# EasyEDA schematic SCH_two-displays_2025-10-05.json
TITLE: Two display module; REV: 1.0; Date: 2025-07-05; Sheet: 1/1; Drawn By: Jakub Pelc; Company: swpelc.eu
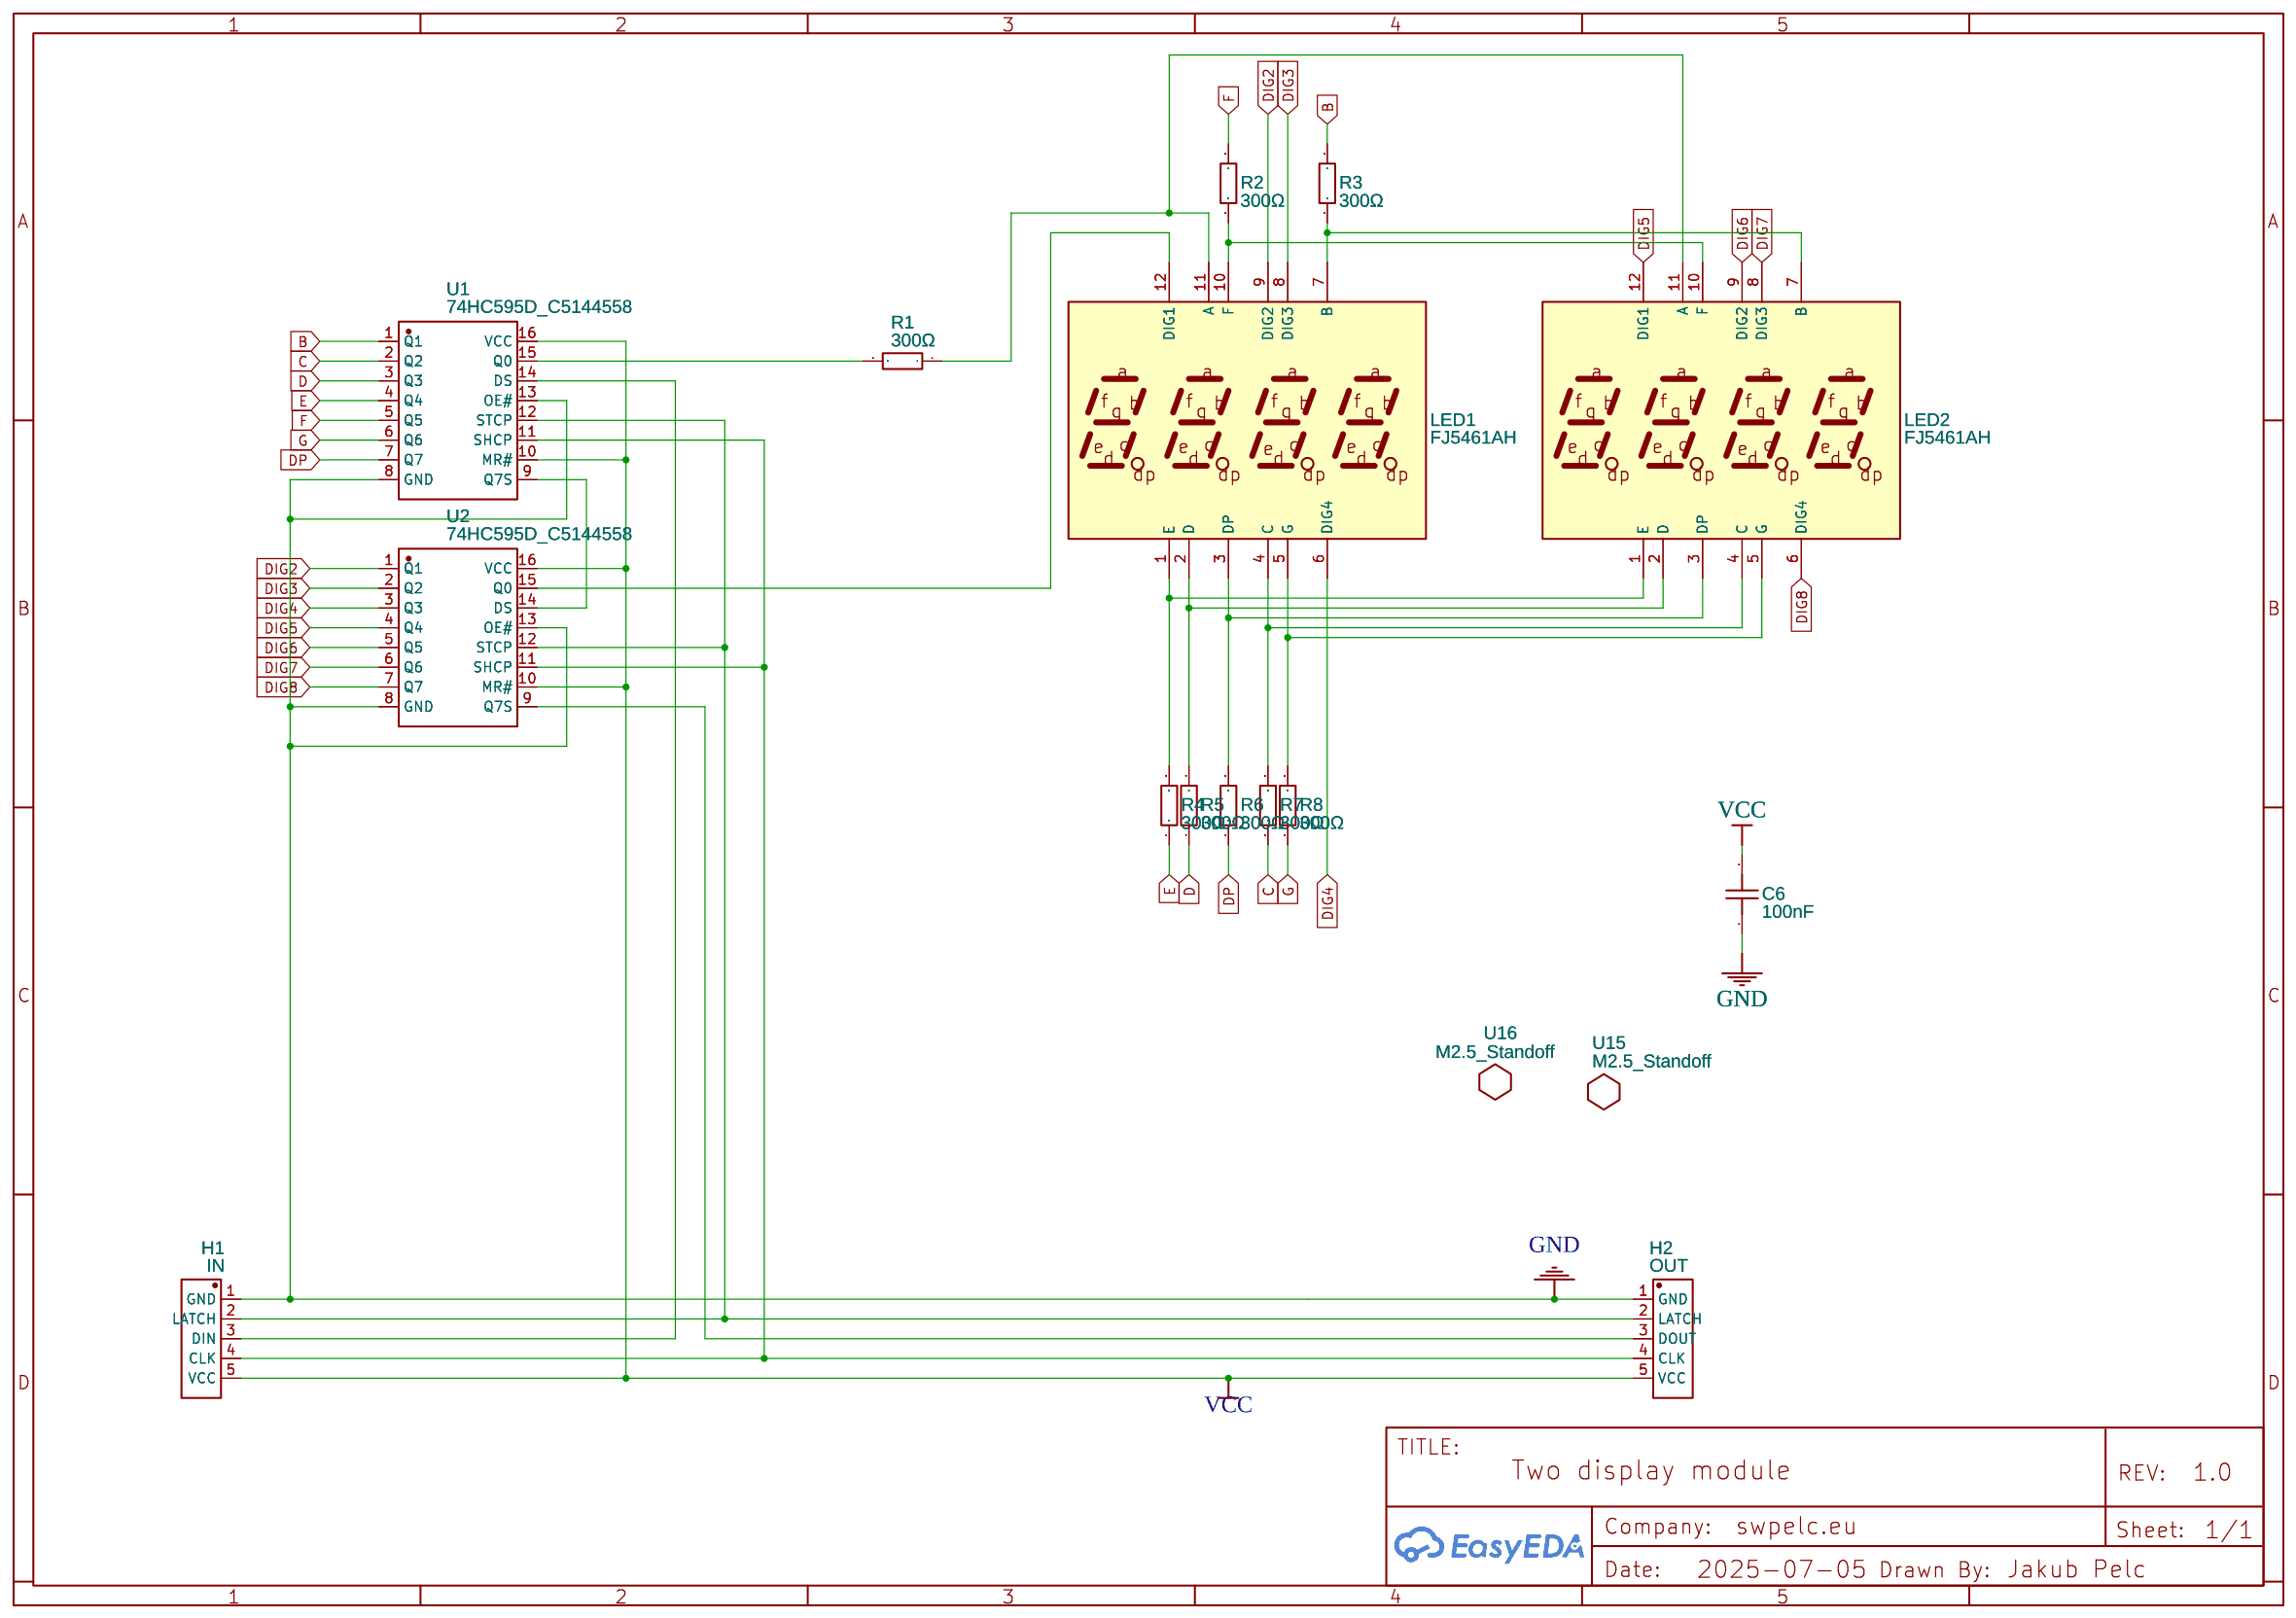
[diagram p0: schematic sheet]

## Parts
C6  100nF  [C0603]
H1  IN  [HEADER-HEADER-FEMALE-2.54_1X5]
H2  OUT  [HEADER-HEADER-FEMALE-2.54_1X5]
LED1  FJ5461AH  [LED-SEG-TH_12P-L50.3-W19.0-P2.54-S15.24-BL]
LED2  FJ5461AH  [LED-SEG-TH_12P-L50.3-W19.0-P2.54-S15.24-BL]
R1  300Ω  [R0603]
R2  300Ω  [R0603]
R3  300Ω  [R0603]
R4  300Ω  [R0603]
R5  300Ω  [R0603]
R6  300Ω  [R0603]
R7  300Ω  [R0603]
R8  300Ω  [R0603]
U1  74HC595D_C5144558  [SOIC-16_L9.9-W3.9-P1.27-LS6.0-BL]
U2  74HC595D_C5144558  [SOIC-16_L9.9-W3.9-P1.27-LS6.0-BL]
U15  M2.5_Standoff  [M2.5_STANDOFF]
U16  M2.5_Standoff  [M2.5_STANDOFF]

## Library data of the parts
C6 = CC0603KRX7R9BB104: Supplier: LCSC; Manufacturer: YAGEO(国巨); Supplier Part: C14663; JLCPCB Part Class: Basic Part
H1 H2 = HEADER - 2.54_1X5: Contributor: sohail.hdesign
LED1 LED2 = FJ5461AH: Supplier: LCSC; Manufacturer: 志浩; Manufacturer Part: FJ5461AH 橙红; Supplier Part: C10709; JLCPCB Part Class: Extended Part
R1-R8 = AR03DTC3000: Contributor: LCSC; Supplier: LCSC; Supplier Part: C374566; Manufacturer: Viking(光颉); JLCPCB Part Class: Extended Part
U1 U2 = 74HC595D_C5144558: Supplier: LCSC; Supplier Part: C5144558; Manufacturer: JSMSEMI(杰盛微); Manufacturer Part: 74HC595D; JLCPCB Part Class: Extended Part; Contributor: lcsc
U15 U16 = M2.5_Standoff: Contributor: michael_6605

## Nets
GND: C6.1 H1.1(GND) H2.1(GND) U1.8(GND) U1.13(OE#) U2.8(GND) U2.13(OE#)
VCC: C6.2 H1.5(VCC) H2.5(VCC) U1.10(MR#) U1.16(VCC) U2.10(MR#) U2.16(VCC)
B: R3.2 U1.1(Q1)
C: R7.1 U1.2(Q2)
D: R5.1 U1.3(Q3)
DIG2: LED1.9(DIG2) U2.1(Q1)
DIG3: LED1.8(DIG3) U2.2(Q2)
DIG4: LED1.6(DIG4) U2.3(Q3)
DIG5: LED2.12(DIG1) U2.4(Q4)
DIG6: LED2.9(DIG2) U2.5(Q5)
DIG7: LED2.8(DIG3) U2.6(Q6)
DIG8: LED2.6(DIG4) U2.7(Q7)
DP: R6.1 U1.7(Q7)
E: R4.1 U1.4(Q4)
F: R2.2 U1.5(Q5)
G: R8.1 U1.6(Q6)
Net-(H1-2): H1.2(LATCH) H2.2(LATCH) U1.12(STCP) U2.12(STCP)
Net-(H1-3): H1.3(DIN) U1.14(DS)
Net-(H1-4): H1.4(CLK) H2.4(CLK) U1.11(SHCP) U2.11(SHCP)
Net-(H2-3): H2.3(DOUT) U2.9(Q7S)
Net-(LED1-1): LED1.1(E) LED2.1(E) R4.2
Net-(LED1-2): LED1.2(D) LED2.2(D) R5.2
Net-(LED1-3): LED1.3(DP) LED2.3(DP) R6.2
Net-(LED1-4): LED1.4(C) LED2.4(C) R7.2
Net-(LED1-5): LED1.5(G) LED2.5(G) R8.2
Net-(LED1-7): LED1.7(B) LED2.7(B) R3.1
Net-(LED1-10): LED1.10(F) LED2.10(F) R2.1
Net-(LED1-11): LED1.11(A) LED2.11(A) R1.1
Net-(LED1-12): LED1.12(DIG1) U2.15(Q0)
Net-(R1-2): R1.2 U1.15(Q0)
Net-(U1-9): U1.9(Q7S) U2.14(DS)
